# EAGLE schematic APU (EAGLE 9.6.0)
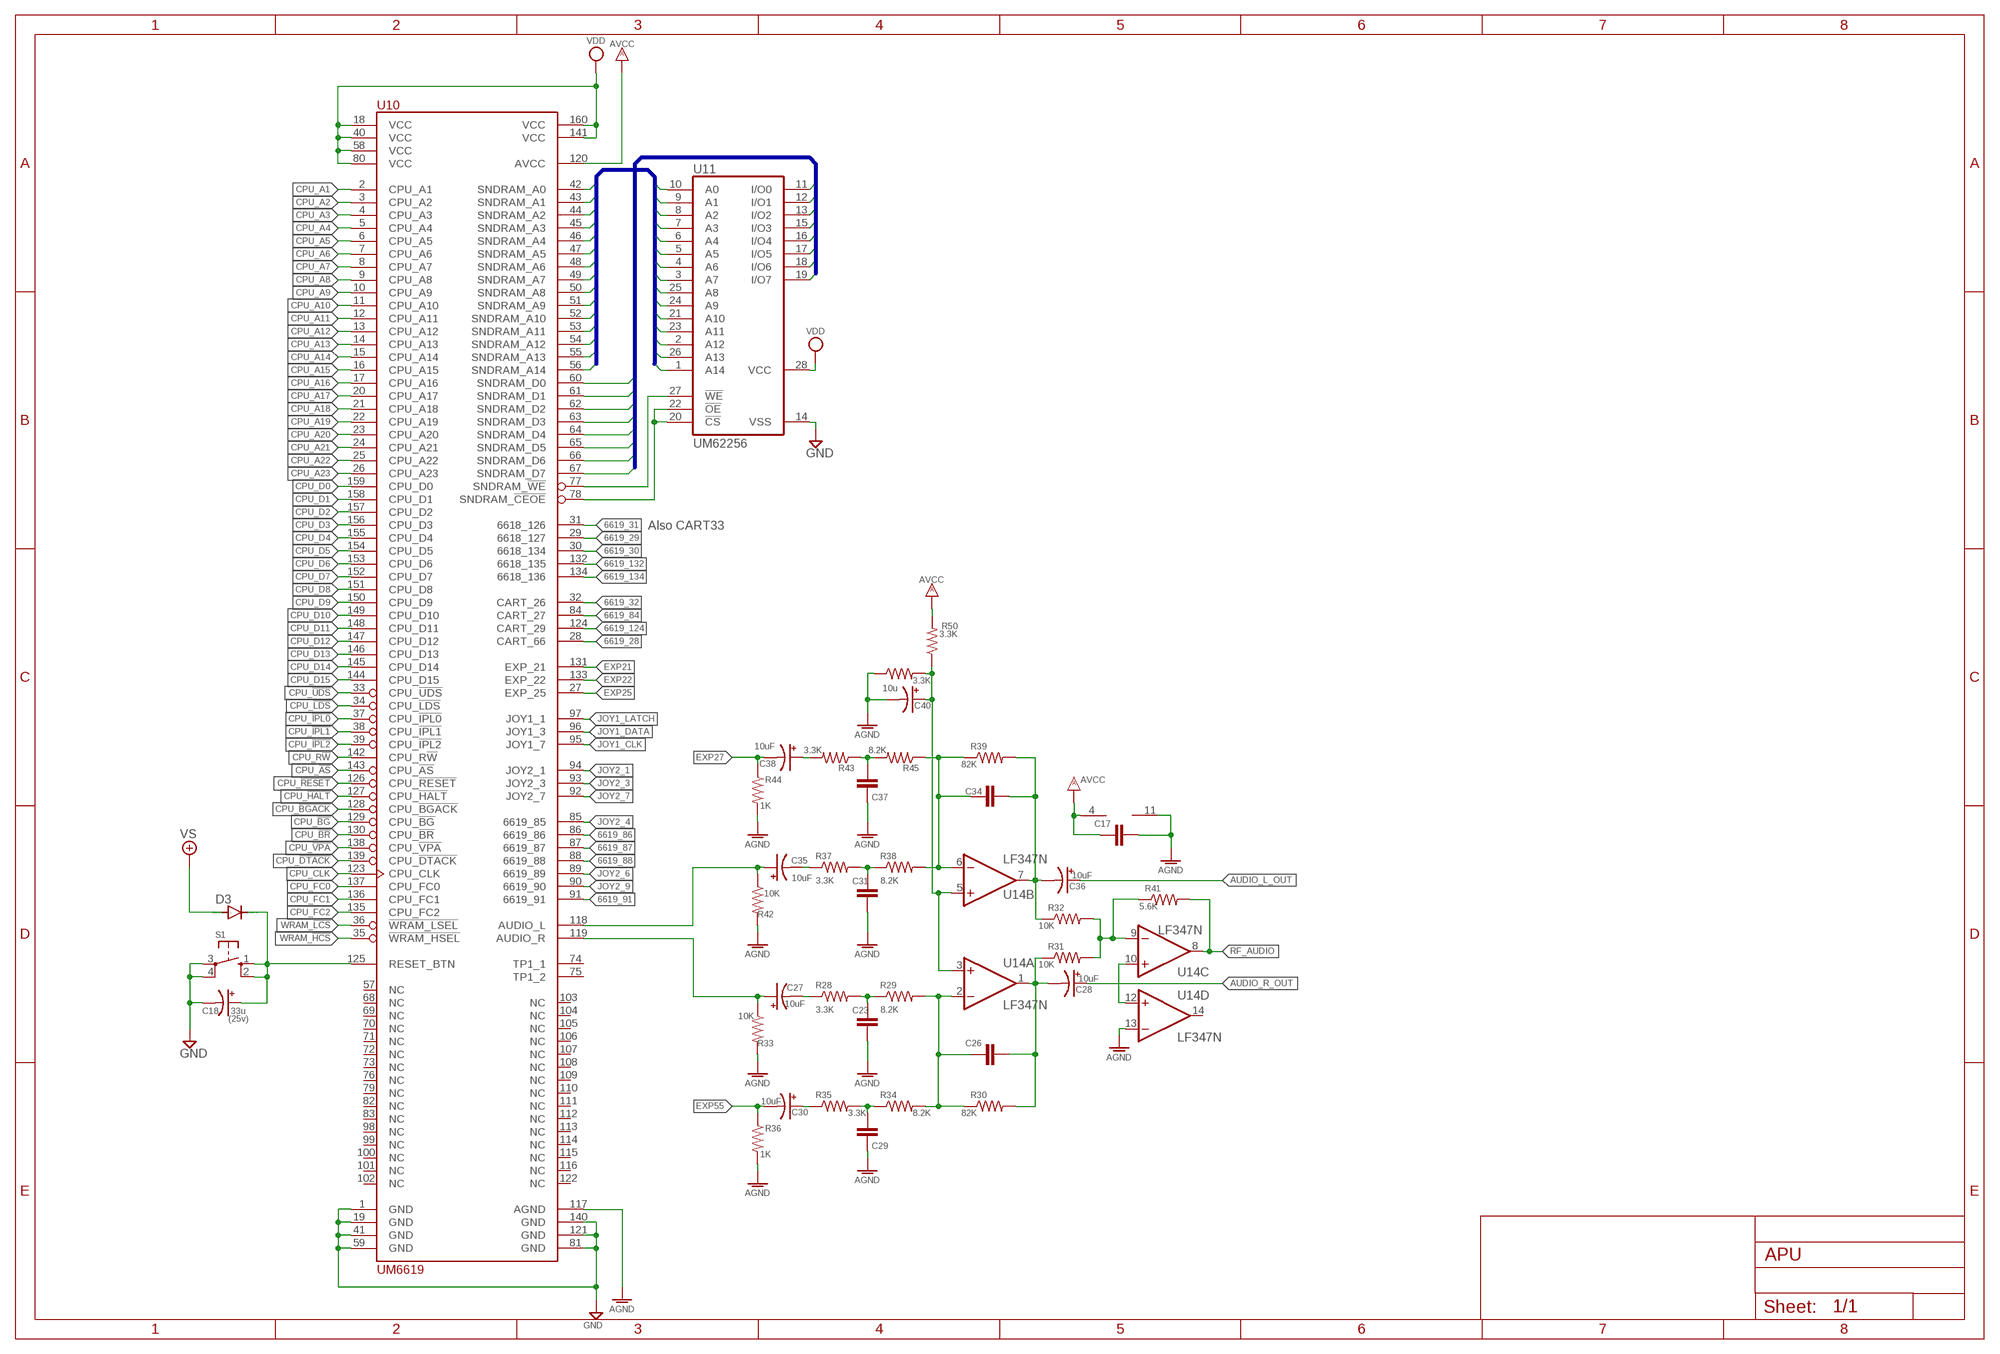
[diagram p0: schematic, sheet 1]

## Parts
C17  C-EUC0805  [C0805]
C18  33u  CPOL-USE2.5-5  [E2,5-5]
C23  C-EUC0805  [C0805]
C26  C-EUC0805  [C0805]
C27  10uF  CPOL-USTAP5-50  [TAP5-50]
C28  10uF  CPOL-USTAP5-50  [TAP5-50]
C29  C-EUC0805  [C0805]
C30  10uF  CPOL-USTAP5-50  [TAP5-50]
C31  C-EUC0805  [C0805]
C34  C-EUC0805  [C0805]
C35  10uF  CPOL-USTAP5-50  [TAP5-50]
C36  10uF  CPOL-USTAP5-50  [TAP5-50]
C37  C-EUC0805  [C0805]
C38  10uF  CPOL-USTAP5-50  [TAP5-50]
C40  10u  CPOL-USTAP5-50  [TAP5-50]
D3  DIODE-SOD80C  [SOD80C]
R28  3.3K  R-US_R0805  [R0805]
R29  8.2K  R-US_R0805  [R0805]
R30  82K  R-US_R0805  [R0805]
R31  10K  R-US_R0805  [R0805]
R32  10K  R-US_R0805  [R0805]
R33  10K  R-US_R0805  [R0805]
R34  8.2K  R-US_R0805  [R0805]
R35  3.3K  R-US_R0805  [R0805]
R36  1K  R-US_R0805  [R0805]
R37  3.3K  R-US_R0805  [R0805]
R38  8.2K  R-US_R0805  [R0805]
R39  82K  R-US_R0805  [R0805]
R41  5.6K  R-US_R0805  [R0805]
R42  10K  R-US_R0805  [R0805]
R43  3.3K  R-US_R0805  [R0805]
R44  1K  R-US_R0805  [R0805]
R45  8.2K  R-US_R0805  [R0805]
R49  3.3K  R-US_R0805  [R0805]
R50  3.3K  R-US_R0805  [R0805]
S1  40-XX  [B3F-40XX]
U10  UM6619  [QFP160]
U11  UM62256  62256FP  [SO28L]
U14  LF347N  [DIL14]

## Nets
6619_28: U10.28(CART_66)
6619_29: U10.29(6618_127)
6619_30: U10.30(6618_134)
6619_31: U10.31(6618_126)
6619_32: U10.32(CART_26)
6619_84: U10.84(CART_27)
6619_86: U10.86(6619_86)
6619_87: U10.87(6619_87)
6619_88: U10.88(6619_88)
6619_91: U10.91(6619_91)
6619_124: U10.124(CART_29)
6619_132: U10.132(6618_135)
6619_134: U10.134(6618_136)
AGND: C17.2 C23.2 C29.2 C31.2 C37.2 C40.- R33.2 R36.2 R42.2 R44.2 R49.1 U10.117(AGND) U14.11(P:V-) U14.13(D:-IN)
AUDIO_L_OUT: C36.+
AUDIO_R_OUT: C28.+
AVCC: C17.1 R50.2 U10.120(AVCC) U14.4(P:V+)
CPU_!AS: U10.143(CPU_!AS)
CPU_!BG: U10.129(CPU_!BG)
CPU_!BGACK: U10.128(CPU_!BGACK)
CPU_!BR: U10.130(CPU_!BR)
CPU_!DTACK: U10.139(CPU_!DTACK)
CPU_!HALT: U10.127(CPU_!HALT)
CPU_!IPL0: U10.37(CPU_!IPL0)
CPU_!IPL1: U10.38(CPU_!IPL1)
CPU_!IPL2: U10.39(CPU_!IPL2)
CPU_!LDS: U10.34(CPU_!LDS)
CPU_!RESET: U10.126(CPU_!RESET)
CPU_!UDS: U10.33(CPU_!UDS)
CPU_!VPA: U10.138(CPU_!VPA)
CPU_A1: U10.2(CPU_A1)
CPU_A2: U10.3(CPU_A2)
CPU_A3: U10.4(CPU_A3)
CPU_A4: U10.5(CPU_A4)
CPU_A5: U10.6(CPU_A5)
CPU_A6: U10.7(CPU_A6)
CPU_A7: U10.8(CPU_A7)
CPU_A8: U10.9(CPU_A8)
CPU_A9: U10.10(CPU_A9)
CPU_A10: U10.11(CPU_A10)
CPU_A11: U10.12(CPU_A11)
CPU_A12: U10.13(CPU_A12)
CPU_A13: U10.14(CPU_A13)
CPU_A14: U10.15(CPU_A14)
CPU_A15: U10.16(CPU_A15)
CPU_A16: U10.17(CPU_A16)
CPU_A17: U10.20(CPU_A17)
CPU_A18: U10.21(CPU_A18)
CPU_A19: U10.22(CPU_A19)
CPU_A20: U10.23(CPU_A20)
CPU_A21: U10.24(CPU_A21)
CPU_A22: U10.25(CPU_A22)
CPU_A23: U10.26(CPU_A23)
CPU_CLK: U10.123(CPU_CLK)
CPU_D0: U10.159(CPU_D0)
CPU_D1: U10.158(CPU_D1)
CPU_D2: U10.157(CPU_D2)
CPU_D3: U10.156(CPU_D3)
CPU_D4: U10.155(CPU_D4)
CPU_D5: U10.154(CPU_D5)
CPU_D6: U10.153(CPU_D6)
CPU_D7: U10.152(CPU_D7)
CPU_D8: U10.151(CPU_D8)
CPU_D9: U10.150(CPU_D9)
CPU_D10: U10.149(CPU_D10)
CPU_D11: U10.148(CPU_D11)
CPU_D12: U10.147(CPU_D12)
CPU_D13: U10.146(CPU_D13)
CPU_D14: U10.145(CPU_D14)
CPU_D15: U10.144(CPU_D15)
CPU_FC0: U10.137(CPU_FC0)
CPU_FC1: U10.136(CPU_FC1)
CPU_FC2: U10.135(CPU_FC2)
CPU_R!W: U10.142(CPU_R!W)
EXP21: U10.131(EXP_21)
EXP22: U10.133(EXP_22)
EXP25: U10.27(EXP_25)
EXP27: C38.- R44.1
EXP55: C30.- R36.1
GND: C18.- S1.3(P) S1.4(P1) U10.1(GND) U10.19(GND) U10.41(GND) U10.59(GND) U10.81(GND) U10.121(GND) U10.140(GND) U11.14(VSS)
JOY1_CLK: U10.95(JOY1_7)
JOY1_DATA: U10.96(JOY1_3)
JOY1_LATCH: U10.97(JOY1_1)
JOY2_1: U10.94(JOY2_1)
JOY2_3: U10.93(JOY2_3)
JOY2_4: U10.85(6619_85)
JOY2_6: U10.89(6619_89)
JOY2_7: U10.92(JOY2_7)
JOY2_9: U10.90(6619_90)
N$1: C18.+ D3.C S1.1(S) S1.2(S1) U10.125(RESET_BTN)
N$2: U10.77(SNDRAM_!WE) U11.27(!WE)
N$3: C29.1 R34.1 R35.2
N$4: C27.+ R33.1 U10.119(AUDIO_R)
N$5: C35.- R37.1
N$6: C34.1 R38.2 R39.1 R45.1 U14.6(B:-IN)
N$7: C27.- R28.1
N$8: C31.1 R37.2 R38.1
N$9: C26.1 R29.2 R30.1 R34.2 U14.2(A:-IN)
N$10: C35.+ R42.1 U10.118(AUDIO_L)
N$12: C40.+ R49.2 R50.1 U14.3(A:+IN) U14.5(B:+IN)
N$13: C26.2 C28.- R30.2 R31.1 U14.1(A:OUT)
N$14: C37.1 R43.1 R45.2
N$15: R31.2 R32.2 R41.1 U14.9(C:-IN)
N$16: U10.78(SNDRAM_!CEOE) U11.20(!CS) U11.22(!OE)
N$17: C38.+ R43.2
N$18: C34.2 C36.- R32.1 R39.2 U14.7(B:OUT)
N$19: U14.10(C:+IN) U14.12(D:+IN)
N$20: C23.1 R28.2 R29.1
N$21: C30.+ R35.1
RF_AUDIO: R41.2 U14.8(C:OUT)
SNDRAM_A0: U10.42(SNDRAM_A0) U11.10(A0)
SNDRAM_A1: U10.43(SNDRAM_A1) U11.9(A1)
SNDRAM_A2: U10.44(SNDRAM_A2) U11.8(A2)
SNDRAM_A3: U10.45(SNDRAM_A3) U11.7(A3)
SNDRAM_A4: U10.46(SNDRAM_A4) U11.6(A4)
SNDRAM_A5: U10.47(SNDRAM_A5) U11.5(A5)
SNDRAM_A6: U10.48(SNDRAM_A6) U11.4(A6)
SNDRAM_A7: U10.49(SNDRAM_A7) U11.3(A7)
SNDRAM_A8: U10.50(SNDRAM_A8) U11.25(A8)
SNDRAM_A9: U10.51(SNDRAM_A9) U11.24(A9)
SNDRAM_A10: U10.52(SNDRAM_A10) U11.21(A10)
SNDRAM_A11: U10.53(SNDRAM_A11) U11.23(A11)
SNDRAM_A12: U10.54(SNDRAM_A12) U11.2(A12)
SNDRAM_A13: U10.55(SNDRAM_A13) U11.26(A13)
SNDRAM_A14: U10.56(SNDRAM_A14) U11.1(A14)
SNDRAM_D0: U10.60(SNDRAM_D0) U11.11(I/O0)
SNDRAM_D1: U10.61(SNDRAM_D1) U11.12(I/O1)
SNDRAM_D2: U10.62(SNDRAM_D2) U11.13(I/O2)
SNDRAM_D3: U10.63(SNDRAM_D3) U11.15(I/O3)
SNDRAM_D4: U10.64(SNDRAM_D4) U11.16(I/O4)
SNDRAM_D5: U10.65(SNDRAM_D5) U11.17(I/O5)
SNDRAM_D6: U10.66(SNDRAM_D6) U11.18(I/O6)
SNDRAM_D7: U10.67(SNDRAM_D7) U11.19(I/O7)
VDD: U10.18(VCC) U10.40(VCC) U10.58(VCC) U10.80(VCC) U10.141(VCC) U10.160(VCC) U11.28(VCC)
VS: D3.A
WRAM_!HCS: U10.35(!WRAM_HSEL)
WRAM_!LCS: U10.36(!WRAM_LSEL)
Unconnected: U10.57(NC) U10.68(NC) U10.69(NC) U10.70(NC) U10.71(NC) U10.72(NC) U10.73(NC) U10.74(TP1_1) U10.75(TP1_2) U10.76(NC) U10.79(NC) U10.82(NC) U10.83(NC) U10.98(NC) U10.99(NC) U10.100(NC) U10.101(NC) U10.102(NC) U10.103(NC) U10.104(NC) U10.105(NC) U10.106(NC) U10.107(NC) U10.108(NC) U10.109(NC) U10.110(NC) U10.111(NC) U10.112(NC) U10.113(NC) U10.114(NC) U10.115(NC) U10.116(NC) U10.122(NC) U14.14(D:OUT)

## Buses
SNDRAM_A[0..14]
SNDRAM_D[0..7]

## Notes on the sheet
- Also CART33
- (25v)

## Library data of the parts
C17 C23 C26 C29 C31 C34 C37 = rcl:C-EU: CAPACITOR, European symbol; SPICEPREFIX: C
C18 C27 C28 C30 C35 C36 C38 C40 = rcl:CPOL-US: POLARIZED CAPACITOR, American symbol; SPICEPREFIX: C
D3 = diode:DIODE-: DIODE
R28-R39 R41-R45 R49 R50 = rcl:R-US_: RESISTOR, American symbol; SPICEPREFIX: R
S1 = switch-omron:40-XX: OMRON SWITCH; MF: OMRON COMPONENTS USA; MPN: B3F-4000; OC_FARNELL: 176434; OC_NEWARK: 36K3105
U10 = acan:UM6619: UM6619 APU/IO
U11 = memory-hitachi:62256FP: MEMORY; MPN: CY62256VNLL-70SNXI; OC_FARNELL: 1650073; OC_NEWARK: 19M2582
U14 = linear:LF347: OP AMP